# Altium project Analog.PrjPCB
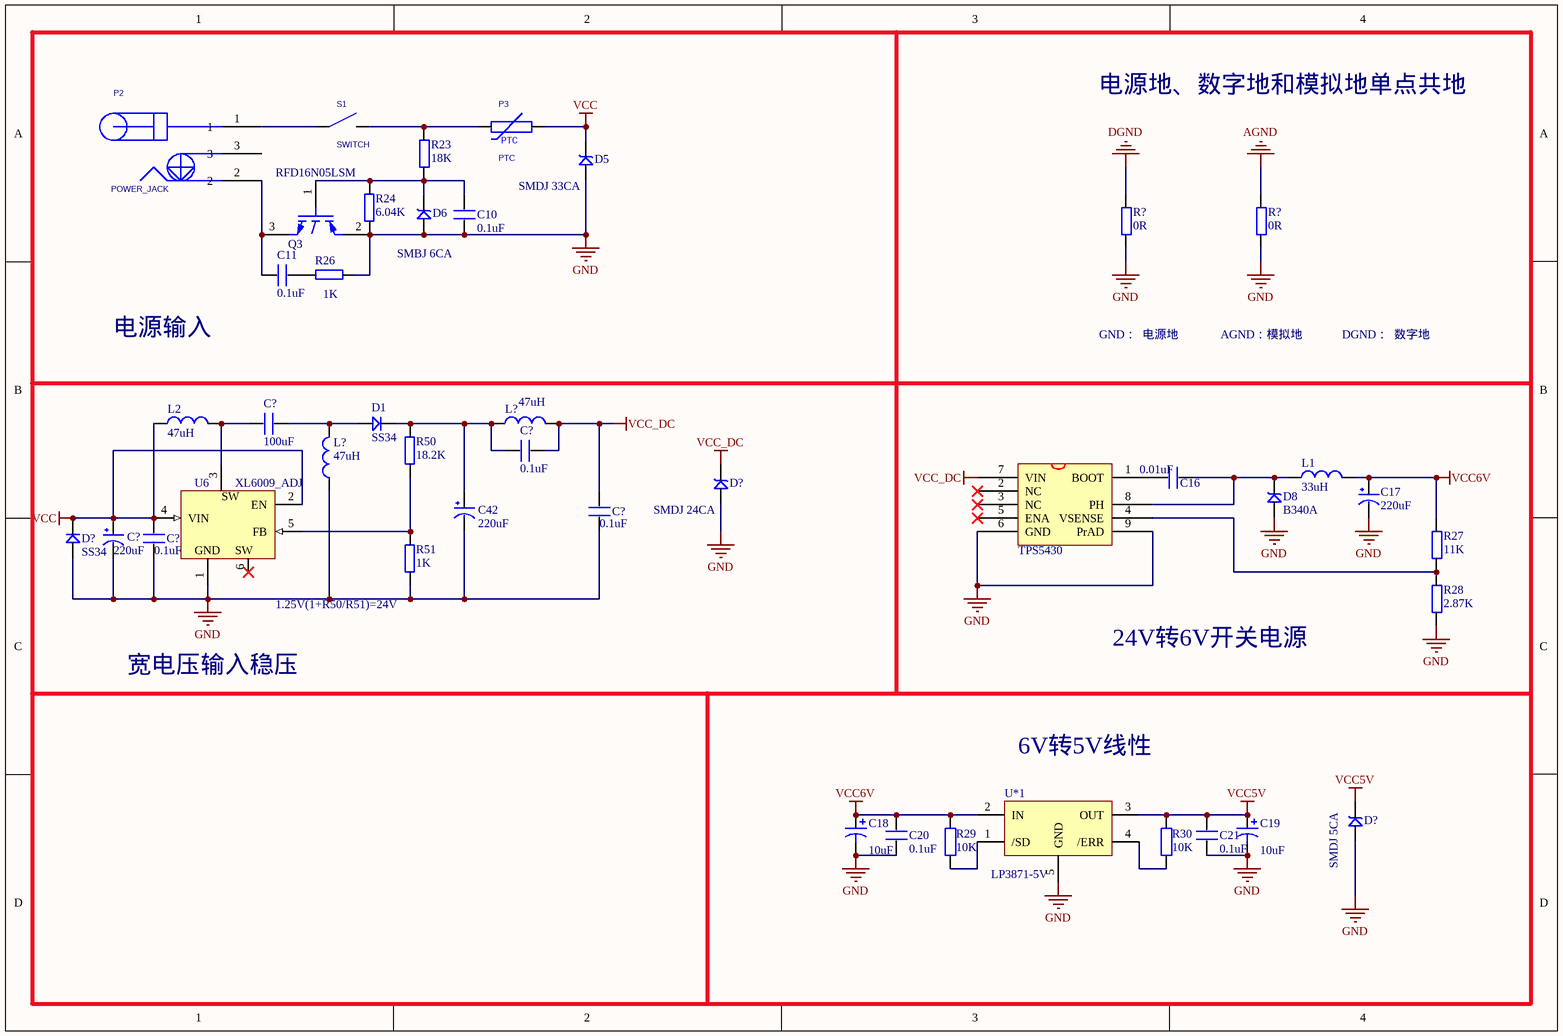
[diagram p0: Power.SchDoc]
3 sheets, 95 parts. Net scope: global (net labels, ports and power ports of the same name join across sheets).
Board file: DataCollectionV1.0£¨18-7-31£©.PcbDoc
Sheets:
  Power.SchDoc
  Digital.SchDoc
  ADC.SchDoc

## Sheet Power.SchDoc
size A4

### Parts
(Parts that share a designator on the sheet are numbered #1, #2 ... from top to bottom, then left to right.)
C10  0.1uF  [0603]
C11  0.1uF  [0603]
C16  0.01uF  [0603]
C17  220uF  [CAP-7343]
C18  value 10uF  [CAP-3216]  (hidden comment: Cap Pol3)
C19  value 10uF  [CAP-3216]  (hidden comment: Cap Pol3)
C20  0.1uF  [0603]
C21  0.1uF  [0603]
C42  220uF  [SMD6]
C?#1  100uF  [0603]
C?#2  0.1uF  [0603]
C?#3  0.1uF  [0603]
C?#4  0.1uF  [0603]
C?#5  220uF  [SMD6]
D1  SS34  [DO-214AC]
D5  SMDJ 33CA  [DO-214AA]
D6  SMBJ 6CA  [DO-214AA]
D8  B340A  [SMBJ]
D?#1  SMDJ 24CA  [DO-214AA]
D?#2  SS34  [DO-214AC]
D?#3  SMDJ 5CA  [DO-214AA]
L1  value 33uH  [L-SMD-10]  (hidden comment: Inductor)
L2  value 47uH  [L-SMD-12]  (hidden comment: Inductor)
L?#1  value 47uH  [L-SMD-10]  (hidden comment: Inductor)
L?#2  value 47uH  [L-SMD-12]  (hidden comment: Inductor)
P2  POWER_JACK  [DC_IN]
P3  PTC  [1812]
Q3  RFD16N05LSM  [TO-252AA]
R23  18K  [0603]
R24  6.04K  [0603]
R26  1K  [0603]
R27  11K  [0603]
R28  2.87K  [0603]
R29  value 10K  [0603]  (hidden comment: Res1)
R30  value 10K  [0603]  (hidden comment: Res1)
R50  18.2K  [0603]
R51  1K  [0603]
R?#1  0R  [0603]
R?#2  0R  [0603]
S1  SWITCH  [Switch_2mm]
TPS5430  TPS  [NSO8_TP4056]  (value not drawn)
U6  XL6009_ADJ  [TO-263-5]
U*1  LP3871-5V  [SOT-223-5]

### Nets
AGND: R?#2.2
DGND: R?#1.2
GND: C10.2 C17.2(GND) C18.2 C19.2 C20.2 C21.2 C42.2(GND) C?#3.2 C?#4.2 C?#5.2(GND) D5.1 D6.1 D8.1 D?#1.1 D?#2.2 D?#3.1 L?#2.1 Q3.2(C) R24.2 R26.1 R28.1 R51.2 R?#1.1 R?#2.1 TPS5430.6(GND) TPS5430.9(PrAD) U6.1(GND) U*1.5(GND)
VCC: C?#4.1 C?#5.1(VCC) D5.2 D?#2.1 L2.1 P3.2 U6.2(EN) U6.4(VIN)
VCC5V: C19.1 C21.1 D?#3.2 R30.2 U*1.3(OUT)
VCC6V: C17.1(VCC) C18.1 C20.1 L1.2 R27.2 R29.2 U*1.2(IN)
VCC_DC: C?#2.2 C?#3.1 D?#1.2 L?#1.2 TPS5430.7(VIN)
NetC10_1: C10.1 D6.2 Q3.1(G) R23.1 R24.1
NetC11_1: C11.1 R26.2
NetC11_2: C11.2 P2.2 Q3.3(E)
NetC16_1: C16.1 TPS5430.1(BOOT)
NetC16_2: C16.2 D8.2 L1.1 TPS5430.8(PH)
NetC42_1: C42.1(VCC) C?#2.1 D1.1 L?#1.1 R50.1
NetC?#1_1: C?#1.1 L2.2 U6.3(SW)
NetC?#1_2: C?#1.2 D1.2 L?#2.2
NetP2_1: P2.1 S1.2
NetP3_1: P3.1 R23.2 S1.1
NetR27_1: R27.1 R28.2 TPS5430.4(VSENSE)
NetR29_1: R29.1 U*1.1(/SD)
NetR30_1: R30.1 U*1.4(/ERR)
NetR50_2: R50.2 R51.1 U6.5(FB)

Not connected (* = marked no-connect by the designer): P2 3; TPS5430 2(NC)* 3(NC)* 5(ENA)*; U6 6(SW)*

### Notes on the sheet
- 电源地、数字地和模拟地单点共地
- 电源输入
- GND：  电源地
- AGND：模拟地
- DGND：  数字地
- 1.25V(1+R50/R51)=24V
- 24V转6V开关电源
- 宽电压输入稳压
- 6V转5V线性

### Library data of the parts
C10 C11 = C_0.1uF: Cap,0.1uF,104; Terabits Part Number: 1C-0000001-XX; Part Type: CAP 0603
C16 C20 C21 C?#1-C?#4 = C
C17 = CAP: 钽电容/220uF(227) ±10% 16V
C18 C19 = Cap Pol3: Polarized Capacitor (Surface Mount); Published: 8-Jun-2000; LatestRevisionDate: 29-May-2009; LatestRevisionNote: IPC-7351 Footprint Added.; PackageReference: C0805; Publisher: Altium Limited; PackageDescription: Chip Capacitor
C42 C?#5 = CAP+_100uF: 钽电容 SMD 6.3*5.5  50V; Terabits Part Number: 1C-0000013-XX; Manufacture Part Number: *; Manufacture: *; Part Type: DIP CAP+,special
D1 D?#2 = D_DIODE LRB: MPN: LRB551V-30T1G; MAN: LRC; TPN: 1D-0000013-XX
D5 D6 D?#1 D?#3 = SMBJ 6.5CA: TVS,SMBJ 6.5CA,600W SMD Transient Voltage Suppressor Diodes,; Terabits Part Number: 1D-0000001-XX; Manufacture: LRC; Part Type: Diode; Manufacture Part Number: SMBJ 6.5CA
D8 = SMBJ: TVS
L1 L2 L?#1 L?#2 = Inductor: 电感; Code_IEC: 1005; Published: 8-Jun-2000; LatestRevisionDate: 17-Jul-2002; LatestRevisionNote: Re-released for DXP Platform.; PackageReference: 0402-A; Publisher: Altium Limited; Code_JEITA: 0402
Q3 = IGBT-N: Insulated Gate Bipolar Transistor (N-Channel); Published: 8-Jun-2000; LatestRevisionDate: 17-Jul-2002; LatestRevisionNote: Re-released for DXP Platform.; DatasheetVersion: PD-9.684A; PackageReference: TO-247; Publisher: Altium Limited; PackageDescription: SIP with Mounting Hole; 3 Leads; Body 20 x 15.6 x 5 mm (typ); Pitch 5.45 mm; Code_JEDEC: TO-247-AC; ComponentLink1Description: Manufacturer Link; ComponentLink1URL: http://www.irf.com/
R23 R24 R26-R28 R50 R51 = R
R29 R30 = Res1: 贴片电阻; Published: 8-Jun-2000; LatestRevisionDate: 17-Jul-2002; LatestRevisionNote: Re-released for DXP Platform.; PackageReference: AXIAL-0.4; Publisher: Altium Limited
R?#1 R?#2 = R_1K: Res,1K,0603; TPN: 1R-0000008-XX
TPS5430 = TPS5430: 降压开关电源芯片; Published: 8-Jun-2000; LatestRevisionDate: 17-Jul-2002; LatestRevisionNote: Re-released for DXP Platform.; PackageReference: RAD-0.3; Publisher: Altium Limited
U6 = XL6009: 宽输入DCDC稳压芯片; Note: Tab is connected to GND; Published: 15-Apr-2002; DatasheetVersion: Dec-1997; PackageReference: TS5B; Publisher: Altium Limited; PackageDescription: D2-PAK; 5 Leads; Body 14.4 (inc. leads) x 10.4 mm (LxW max); ComponentLink1Description: Manufacturer Link; ComponentLink1URL: http://www.national.com/; ComponentLink2Description: Datasheet; ComponentLink2URL: http://www.national.com/ds.cgi/LM/LM2596.pdf; ComponentLink3Description: URL Link1; ComponentLink3URL: http://www.national.com/pf/LM/LM2596.html
U*1 = LP3871: LDO电源芯片5V; Published: 8-Jun-2000; LatestRevisionDate: 17-Jul-2002; LatestRevisionNote: Re-released for DXP Platform.; PackageReference: RAD-0.3; Publisher: Altium Limited

## Sheet Digital.SchDoc
size A4
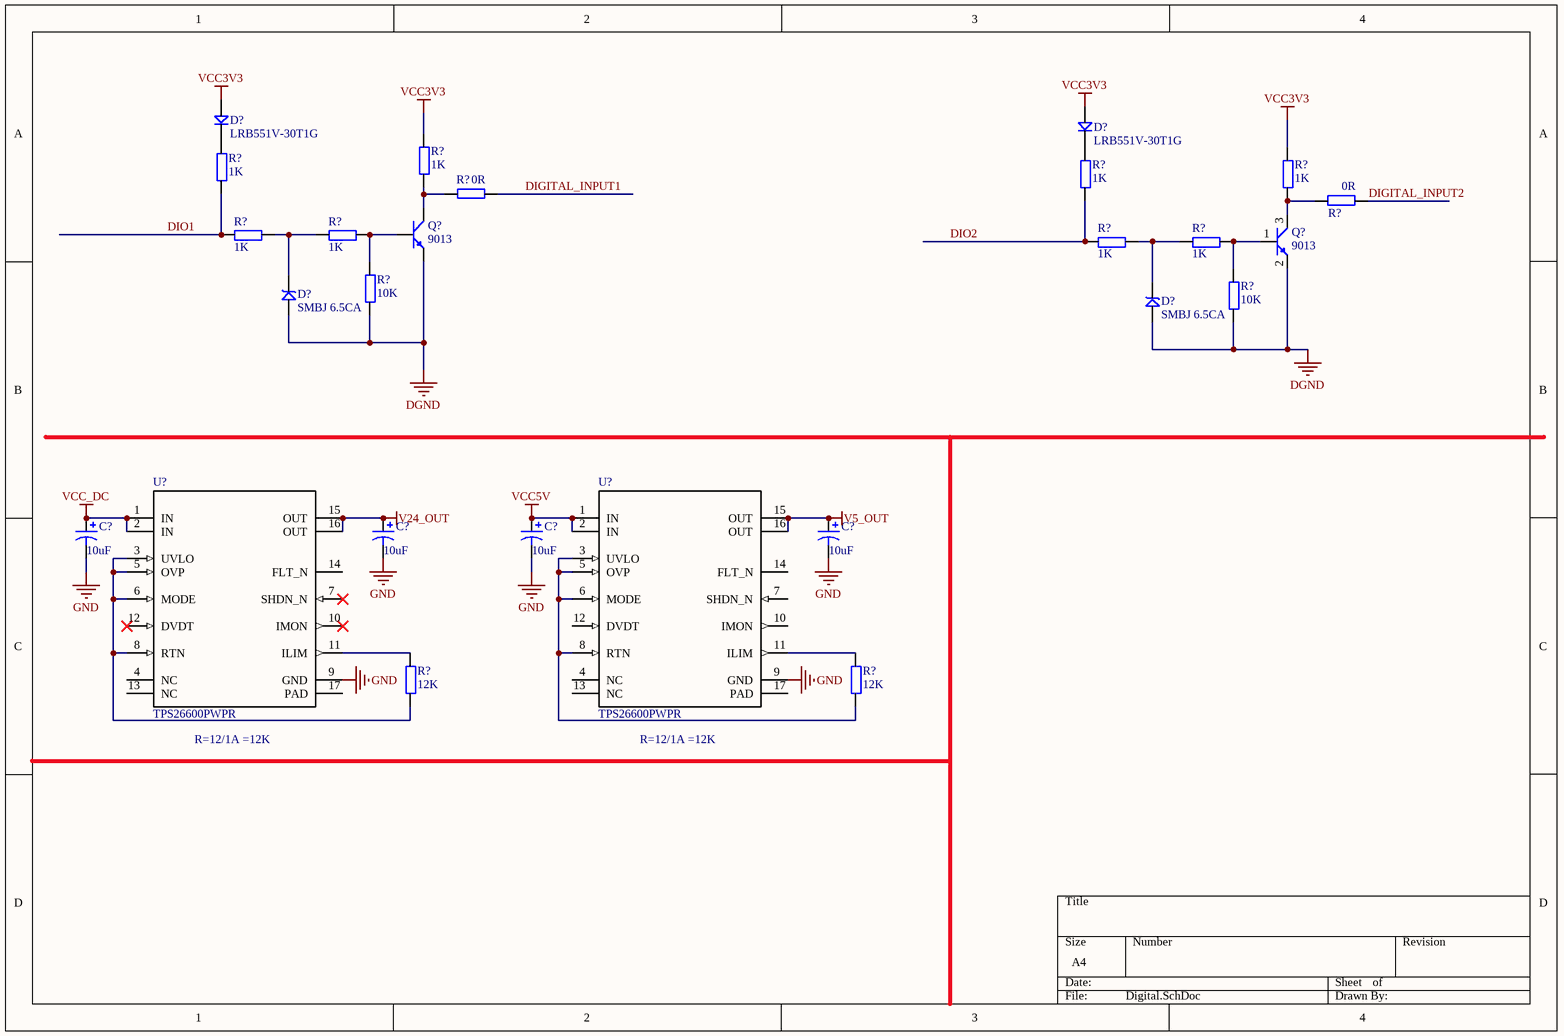
[diagram p1: Digital.SchDoc]

### Parts
(Parts that share a designator on the sheet are numbered #1, #2 ... from top to bottom, then left to right.)
C?#6  value 10uF  [CAP-3216]  (hidden comment: Cap Pol3)
C?#7  value 10uF  [CAP-3216]  (hidden comment: Cap Pol3)
C?#8  value 10uF  [CAP-3216]  (hidden comment: Cap Pol3)
C?#9  value 10uF  [CAP-3216]  (hidden comment: Cap Pol3)
D?#4  LRB551V-30T1G  [SOD-323]
D?#5  LRB551V-30T1G  [SOD-323]
D?#6  SMBJ 6.5CA  [DO-214AA]
D?#7  SMBJ 6.5CA  [DO-214AA]
Q?#1  9013  [SOT-23]
Q?#2  9013  [SOT-23]
R?#3  1K  [0603]
R?#4  1K  [0603]
R?#5  1K  [0603]
R?#6  1K  [0603]
R?#7  1K  [0603]
R?#8  1K  [0603]
R?#9  1K  [0603]
R?#10  1K  [0603]
R?#11  0R  [0603]
R?#12  0R  [0603]
R?#13  10K  [0603]
R?#14  10K  [0603]
R?#15  12K  [0603]
R?#16  12K  [0603]
U?#1  TPS26600PWPR  [PWP0016H_N]
U?#2  TPS26600PWPR  [PWP0016H_N]

### Nets
DGND: D?#6.1 D?#7.1 Q?#1.2(E) Q?#2.2(E) R?#13.1 R?#14.1
GND: C?#6.2 C?#7.2 C?#8.2 C?#9.2 U?#1.9(GND) U?#2.9(GND)
V5_OUT: C?#9.1 U?#2.15(OUT) U?#2.16(OUT)
V24_OUT: C?#7.1 U?#1.15(OUT) U?#1.16(OUT)
VCC3V3: D?#4.2 D?#5.2 R?#3.2 R?#6.2
VCC5V: C?#8.1 U?#2.1(IN) U?#2.2(IN)
VCC_DC: C?#6.1 U?#1.1(IN) U?#1.2(IN)
DIGITAL_INPUT1: R?#11.1
DIGITAL_INPUT2: R?#12.1
DIO1: R?#4.1 R?#7.1
DIO2: R?#5.1 R?#9.1
NetD?#4_1: D?#4.1 R?#4.2
NetD?#5_1: D?#5.1 R?#5.2
NetD?#6_2: D?#6.2 R?#7.2 R?#8.1
NetD?#7_2: D?#7.2 R?#9.2 R?#10.1
NetQ?#1_1: Q?#1.1(B) R?#8.2 R?#13.2
NetQ?#1_3: Q?#1.3(C) R?#3.1 R?#11.2
NetQ?#2_1: Q?#2.1(B) R?#10.2 R?#14.2
NetQ?#2_3: Q?#2.3(C) R?#6.1 R?#12.2
NetR?#15_1: R?#15.1 U?#1.3(UVLO) U?#1.5(OVP) U?#1.6(MODE) U?#1.8(RTN)
NetR?#15_2: R?#15.2 U?#1.11(ILIM)
NetR?#16_1: R?#16.1 U?#2.3(UVLO) U?#2.5(OVP) U?#2.6(MODE) U?#2.8(RTN)
NetR?#16_2: R?#16.2 U?#2.11(ILIM)

Not connected (* = marked no-connect by the designer): U?#1 4(NC) 7(SHDN_N)* 10(IMON)* 12(DVDT)* 13(NC) 14(FLT_N) 17(PAD); U?#2 4(NC) 7(SHDN_N) 10(IMON) 12(DVDT) 13(NC) 14(FLT_N) 17(PAD)

### Notes on the sheet
- (near U?#1) R=12/1A =12K
- (near U?#2) R=12/1A =12K

### Library data of the parts
C?#6-C?#9 = Cap Pol3: Polarized Capacitor (Surface Mount); Published: 8-Jun-2000; LatestRevisionDate: 29-May-2009; LatestRevisionNote: IPC-7351 Footprint Added.; PackageReference: C0805; Publisher: Altium Limited; PackageDescription: Chip Capacitor
D?#4 D?#5 = D_DIODE LRB: LRB551V-30T1G  20V  0.5A 肖特基二极管; MAN: LRC; TPN: 1D-0000013-XX; MPN: LRB551V-30T1G
D?#6 D?#7 = SMBJ 6.5CA: as D5 on sheet Power; Part Type: Diode; Manufacture Part Number: SMBJ 6.5CA
Q?#1 Q?#2 = L2SC4617RT1G: Manufacture: LRC; Terabits Part Number: 1Q-0000001-XX; Part Type: Audion; Manufacture Part Number: L2SC4617RT1G
R?#3 R?#6 R?#8 R?#10 R?#13 R?#14 = R_1K: Res,1K,0603; Terabits Part Number: 1R-0000008-XX; Part Type: RES 0603
R?#4 R?#5 R?#7 R?#9 = R_1K: Res,1K,0603; TPN: 1R-0000008-XX
R?#11 R?#12 R?#15 R?#16 = R
U?#1 U?#2 = TPS26600PWPR: Imported; Manufacturer: Texas Instruments; PartNumber: TPS26600PWPR; RefDes: RefDes; TYPE: TYPE; Value: Value

## Sheet ADC.SchDoc
size A4
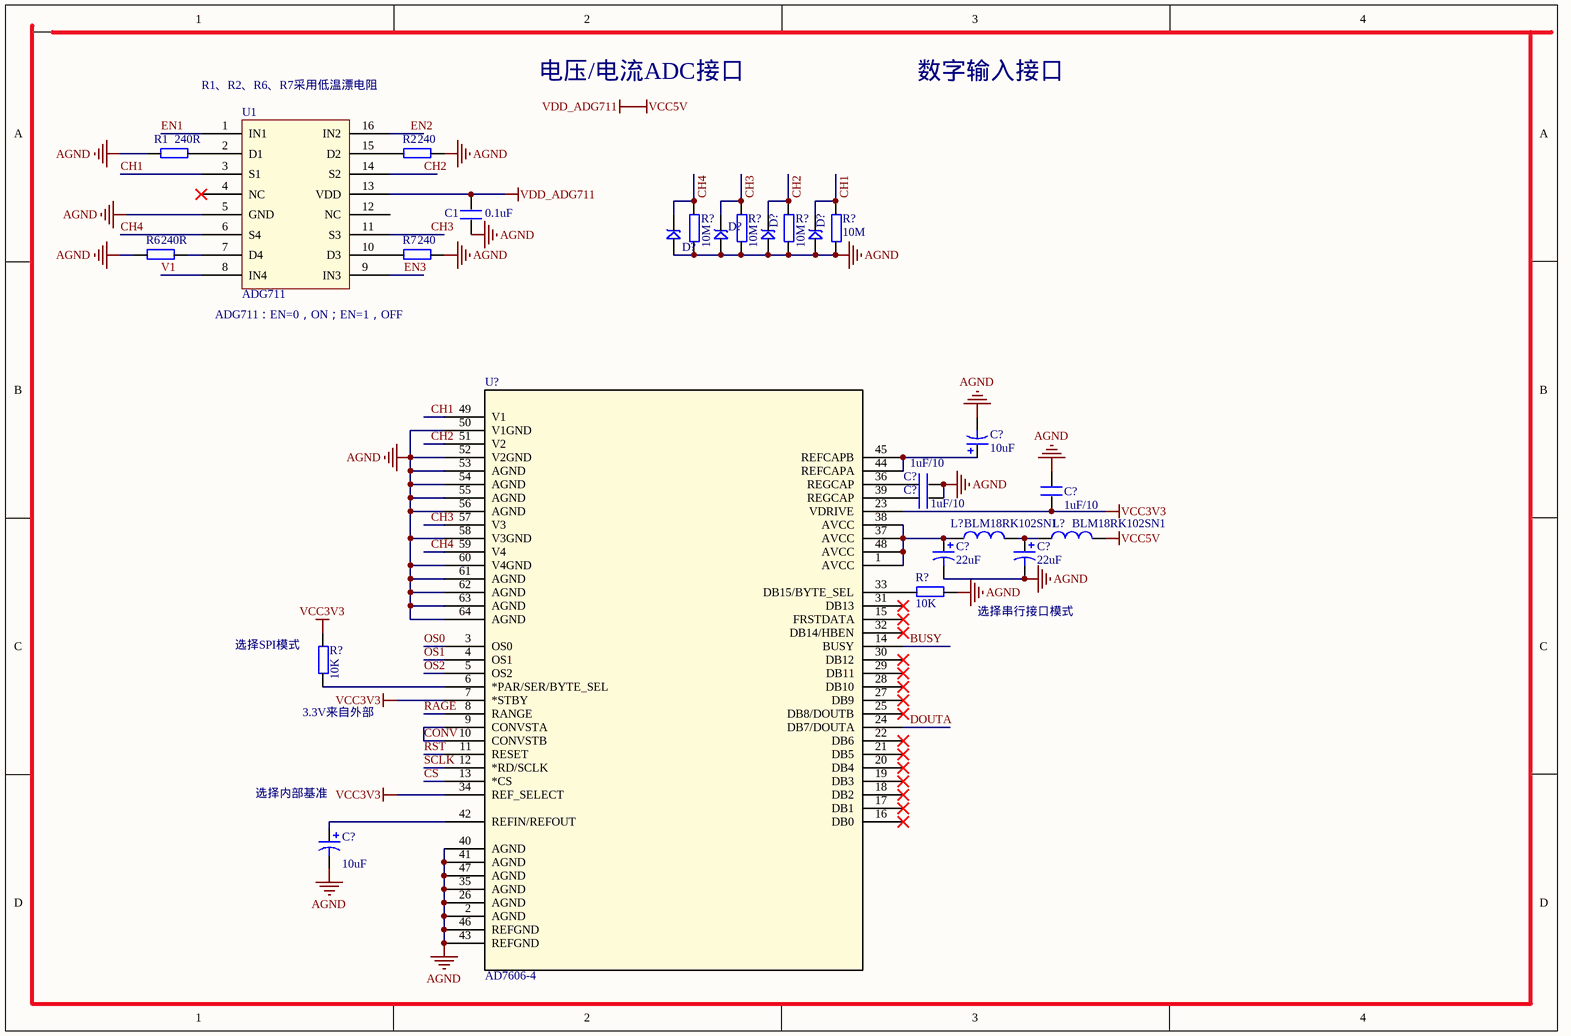
[diagram p2: ADC.SchDoc]

### Parts
(Parts that share a designator on the sheet are numbered #1, #2 ... from top to bottom, then left to right.)
C1  0.1uF  [0603]
C?#10  1uF/10  [0603]
C?#11  value 10uF  [CAP-3216]  (hidden comment: Cap Pol3)
C?#12  1uF/10  [0603]
C?#13  value 22uF  [CAP-3216]  (hidden comment: Cap Pol3)
C?#14  value 22uF  [CAP-3216]  (hidden comment: Cap Pol3)
C?#15  1uF/10  [0603]
C?#16  value 10uF  [CAP-3216]  (hidden comment: Cap Pol3)
D?#8  SMDJ 10CA  [SMC]  (value not drawn)
D?#9  SMDJ 10CA  [SMC]  (value not drawn)
D?#10  SMDJ 10CA  [SMC]  (value not drawn)
D?#11  SMDJ 10CA  [SMC]  (value not drawn)
L?#3  value BLM18RK102SN1  [0603-1]  (hidden comment: Inductor)
L?#4  value BLM18RK102SN1  [0603-1]  (hidden comment: Inductor)
R1  240R  [1206]
R2  240  [1206]
R6  240R  [1206]
R7  240  [1206]
R?#17  10M  [1206]
R?#18  10M  [1206]
R?#19  10M  [1206]
R?#20  10M  [1206]
R?#21  10K  [0603]
R?#22  10K  [0603]
U1  ADG711  [TSSOP16]
U?#3  AD7606-4  [ST_64_2]

### Nets
AGND: C1.1 C?#10.2 C?#11.2 C?#12.2 C?#13.2 C?#14.2 C?#15.2 C?#16.2 D?#8.1 D?#9.1 D?#10.1 D?#11.1 R1.2 R2.1 R6.2 R7.1 R?#17.1 R?#18.1 R?#19.1 R?#20.1 R?#21.1 U1.5(GND) U?#3.2(AGND) U?#3.26(AGND) U?#3.35(AGND) U?#3.40(AGND) U?#3.41(AGND) U?#3.43(REFGND) U?#3.46(REFGND) U?#3.47(AGND) U?#3.50(V1GND) U?#3.52(V2GND) U?#3.53(AGND) U?#3.54(AGND) U?#3.55(AGND) U?#3.56(AGND) U?#3.58(V3GND) U?#3.60(V4GND) U?#3.61(AGND) U?#3.62(AGND) U?#3.63(AGND) U?#3.64(AGND)
VCC3V3: C?#15.1 R?#22.2 U?#3.7(*STBY) U?#3.23(VDRIVE) U?#3.34(REF_SELECT)
VCC5V: C1.2 L?#4.2 U1.13(VDD)  [also labelled VDD_ADG711]
BUSY: U?#3.14(BUSY)
CH1: D?#11.2 R?#20.2 U1.3(S1) U?#3.49(V1)
CH2: D?#10.2 R?#19.2 U1.14(S2) U?#3.51(V2)
CH3: D?#9.2 R?#18.2 U1.11(S3) U?#3.57(V3)
CH4: D?#8.2 R?#17.2 U1.6(S4) U?#3.59(V4)
CONV: U?#3.9(CONVSTA) U?#3.10(CONVSTB)
CS: U?#3.13(*CS)
DOUTA: U?#3.24(DB7/DOUTA)
EN1: U1.1(IN1)
EN2: U1.16(IN2)
EN3: U1.9(IN3)
OS0: U?#3.3(OS0)
OS1: U?#3.4(OS1)
OS2: U?#3.5(OS2)
RAGE: U?#3.8(RANGE)
RST: U?#3.11(RESET)
SCLK: U?#3.12(*RD/SCLK)
V1: U1.8(IN4)
NetC?#10_1: C?#10.1 U?#3.36(REGCAP)
NetC?#11_1: C?#11.1 U?#3.44(REFCAPA) U?#3.45(REFCAPB)
NetC?#12_1: C?#12.1 U?#3.39(REGCAP)
NetC?#13_1: C?#13.1 L?#3.1 U?#3.1(AVCC) U?#3.37(AVCC) U?#3.38(AVCC) U?#3.48(AVCC)
NetC?#14_1: C?#14.1 L?#3.2 L?#4.1
NetC?#16_1: C?#16.1 U?#3.42(REFIN/REFOUT)
NetR1_1: R1.1 U1.2(D1)
NetR2_2: R2.2 U1.15(D2)
NetR6_1: R6.1 U1.7(D4)
NetR7_2: R7.2 U1.10(D3)
NetR?#21_2: R?#21.2 U?#3.33(DB15/BYTE_SEL)
NetR?#22_1: R?#22.1 U?#3.6(*PAR/SER/BYTE_SEL)

Not connected (* = marked no-connect by the designer): U1 4(NC)* 12(NC); U?#3 15(FRSTDATA)* 16(DB0)* 17(DB1)* 18(DB2)* 19(DB3)* 20(DB4)* 21(DB5)* 22(DB6)* 25(DB8/DOUTB)* 27(DB9)* 28(DB10)* 29(DB11)* 30(DB12)* 31(DB13)* 32(DB14/HBEN)*

### Notes on the sheet
- R1、R2、R6、R7采用低温漂电阻
- 电压/电流ADC接口
- 数字输入接口
- (near U1) ADG711：EN=0，ON；EN=1，OFF
- (near R?#22) 选择SPI模式
- 选择串行接口模式
- (near R?#22) 3.3V来自外部
- 选择内部基准

### Library data of the parts
C1 C?#10 C?#12 C?#15 = C
C?#11 C?#13 C?#14 C?#16 = Cap Pol3: Polarized Capacitor (Surface Mount); Published: 8-Jun-2000; LatestRevisionDate: 29-May-2009; LatestRevisionNote: IPC-7351 Footprint Added.; PackageReference: C0805; Publisher: Altium Limited; PackageDescription: Chip Capacitor
D?#8-D?#11 = SMBJ 6.5CA: as D5 on sheet Power; Part Type: Diode; Manufacture Part Number: SMBJ 6.5CA
L?#3 L?#4 = Inductor: 电感; Code_IEC: 1005; Published: 8-Jun-2000; LatestRevisionDate: 17-Jul-2002; LatestRevisionNote: Re-released for DXP Platform.; PackageReference: 0402-A; Publisher: Altium Limited; Code_JEITA: 0402
R1 R2 R6 R7 R?#17-R?#22 = R
U?#3 = AD7606BSTZ: Imported; Value: Value; Type: Type; RefDes: RefDes

## Nets that join several sheets
AGND: Power (R?#2.2), ADC (42 pins)
DGND: Power (R?#1.2), Digital (6 pins)
GND: Power (28 pins), Digital (6 pins)
VCC3V3: Digital (D?#4.2 D?#5.2 R?#3.2 R?#6.2), ADC (5 pins)
VCC5V: Power (5 pins), Digital (C?#8.1 U?#2.1 U?#2.2), ADC (C1.2 L?#4.2 U1.13)
VCC_DC: Power (5 pins), Digital (C?#6.1 U?#1.1 U?#1.2)